# EasyEDA schematic Schematic 1.json
TITLE: Ultraschall Levitation; REV: 1.0; Date: 2018-01-06; Sheet: 1/1; Drawn By: Ulrich Schmerold
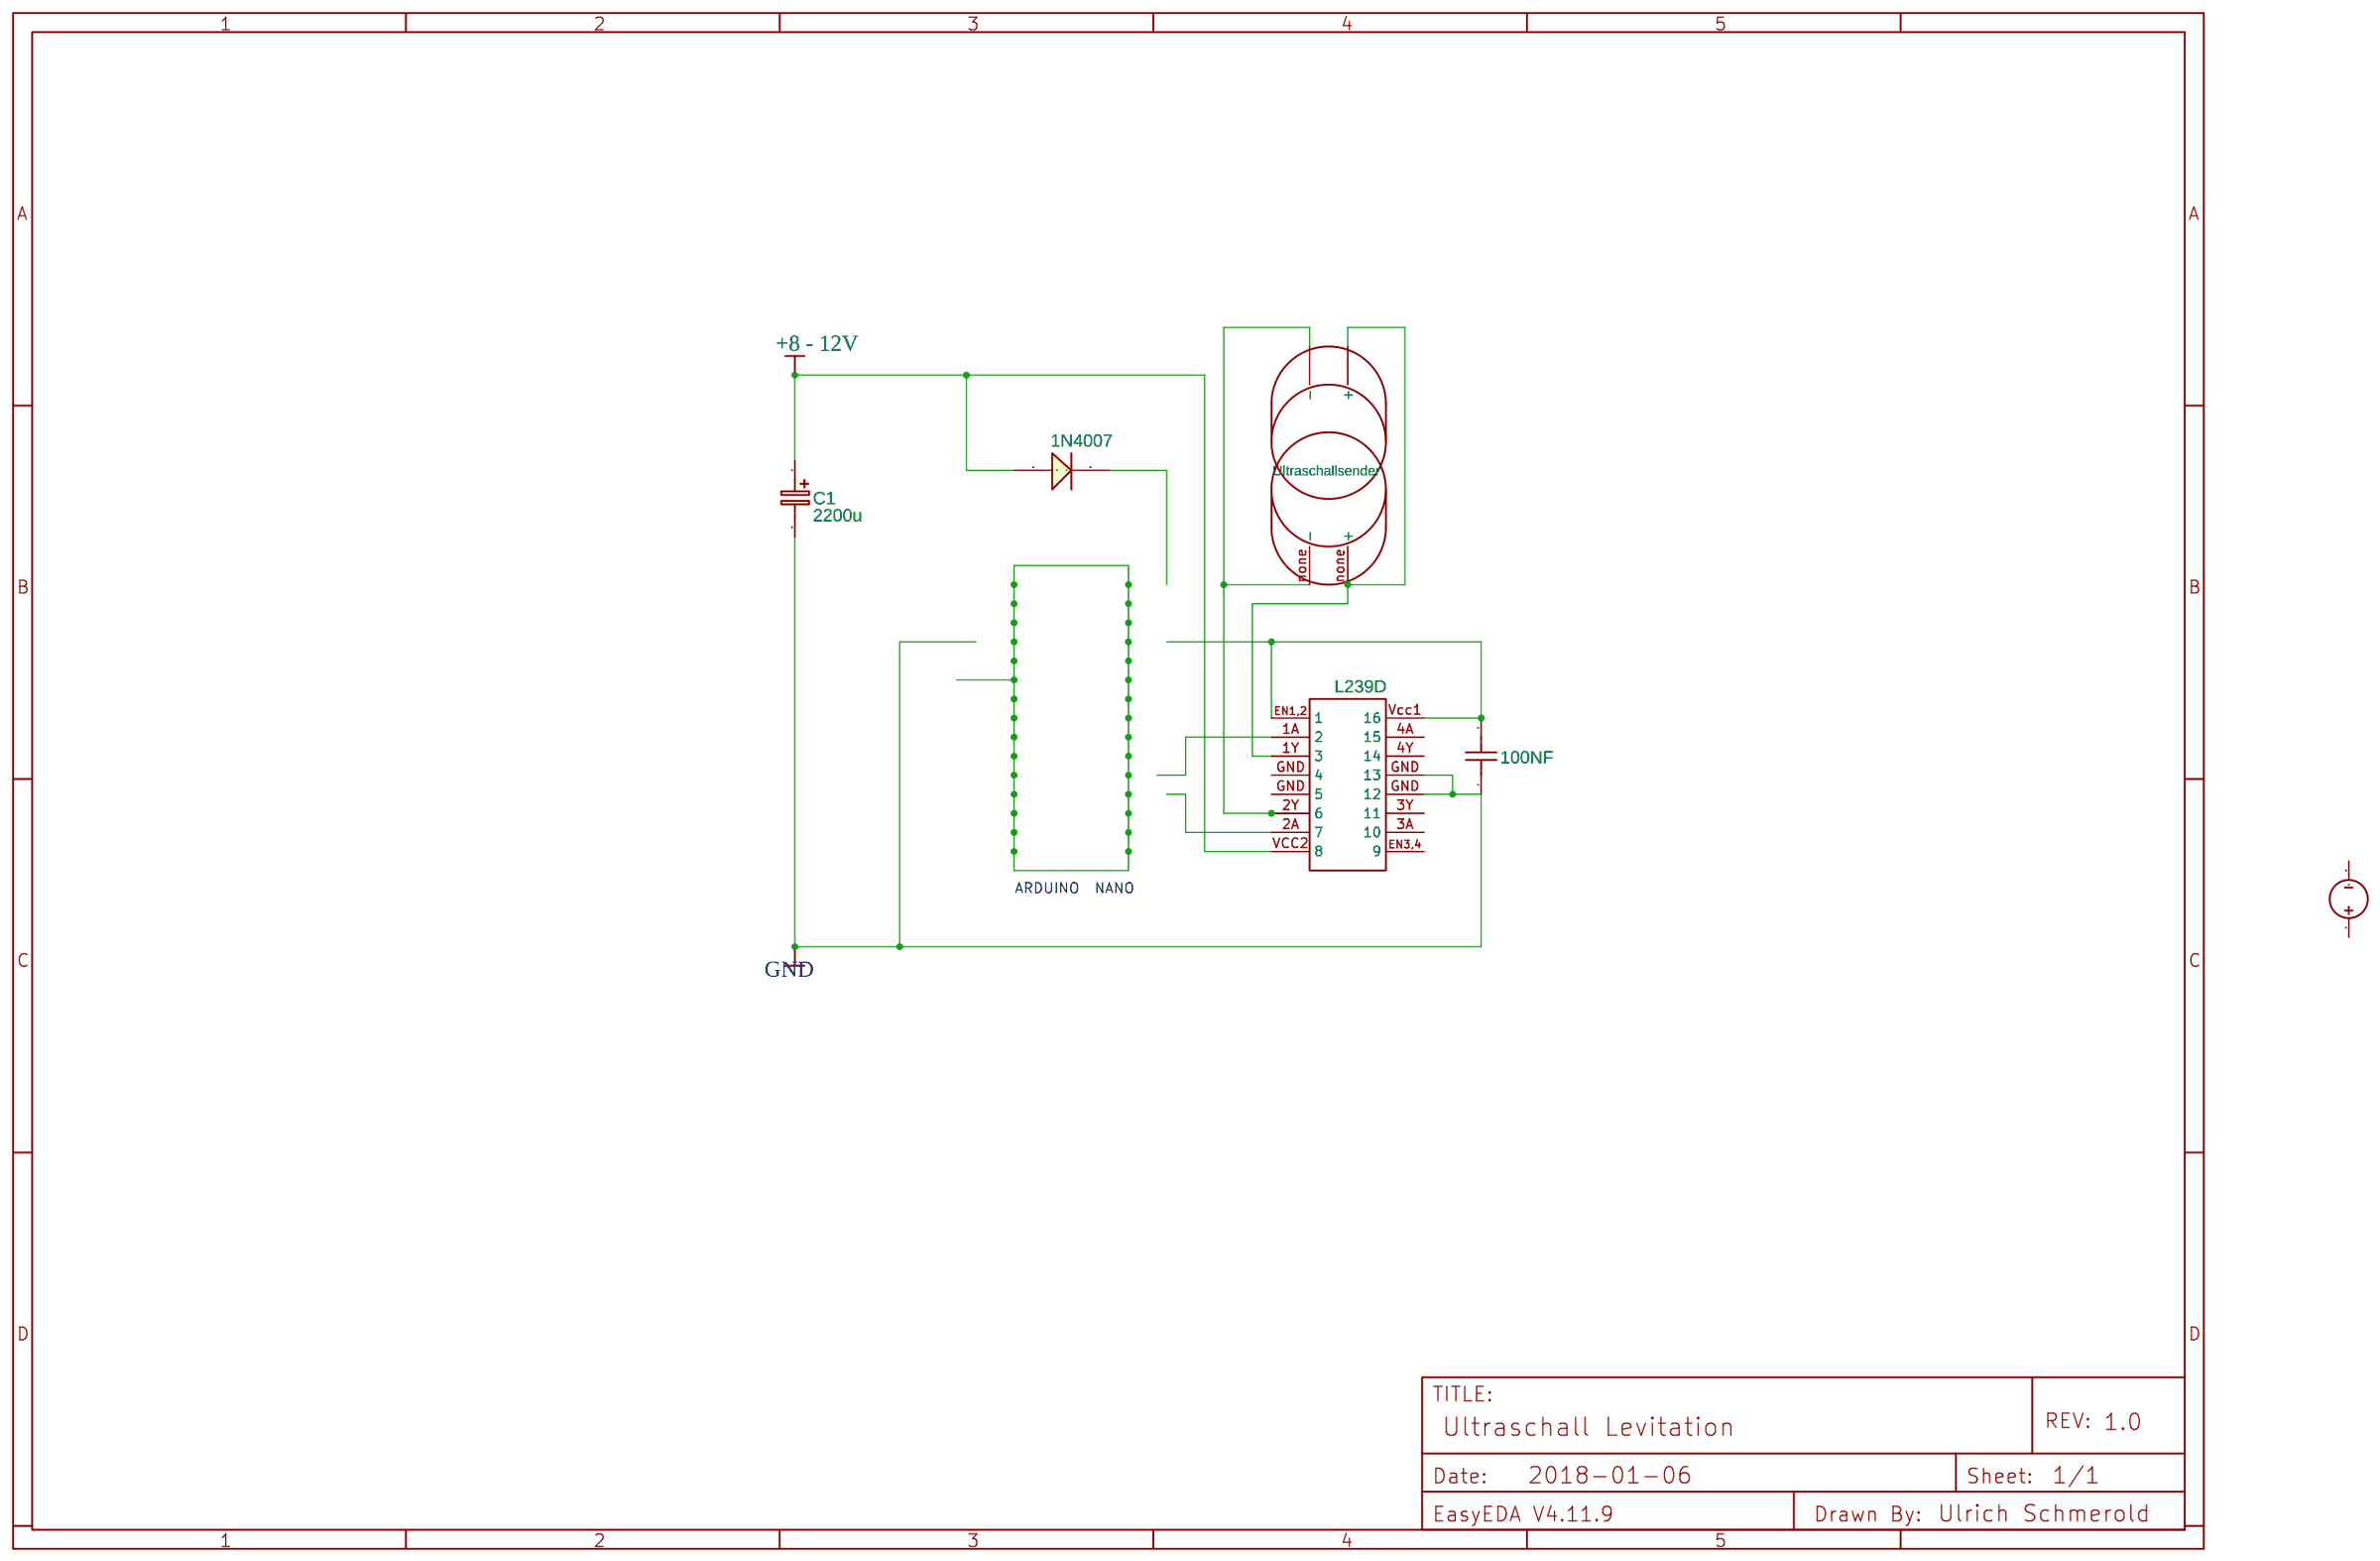
[diagram p0: schematic sheet]

## Parts
6  Ultraschallsender  [HDR1X2]
100NF  100nf  [RAD-0.1]
C1  2200u  [CAP-D3.0XF1.5]
D1  1N4007  [DO-35]
P1  L239D  [HDR-IDC-2.54-2X8P]
U1  Ultrasonic Transductor
U2  Ultrasonic Transductor

## Library data of the parts
6 = Vsin: Manufacturer Part: ?
100NF C1 = Capacitor: Manufacturer Part: ?
D1 = -: LCSC: C14516; Supplier: LCSC; Manufacturer: ST
P1 = -: Manufacturer: LCSC; Mounted: Yes
U1 U2 = -: Contributor: danielrinconr

## Nets
GND: 100NF.1 C1.2 P1.GND(12)
+8 - 12V: C1.1 D1.1(A) P1.VCC2(8)
Net-(100NF-2): 100NF.2 P1.EN1,2(1) P1.Vcc1(16)
Net-(P1-1Y): P1.1Y(3) P1.2Y(6) U1.none(+) U2.(-)

Not connected (* = marked no-connect by the designer): 6 1 2; D1 2(K); P1 1A(2) 2A(7) 3A(10) 3Y(11) 4A(15) 4Y(14) EN3,4(9)

## Notes on the sheet
- ARDUINO  NANO
